# Altium schematic sheet Sheet1.SchDoc
size A4
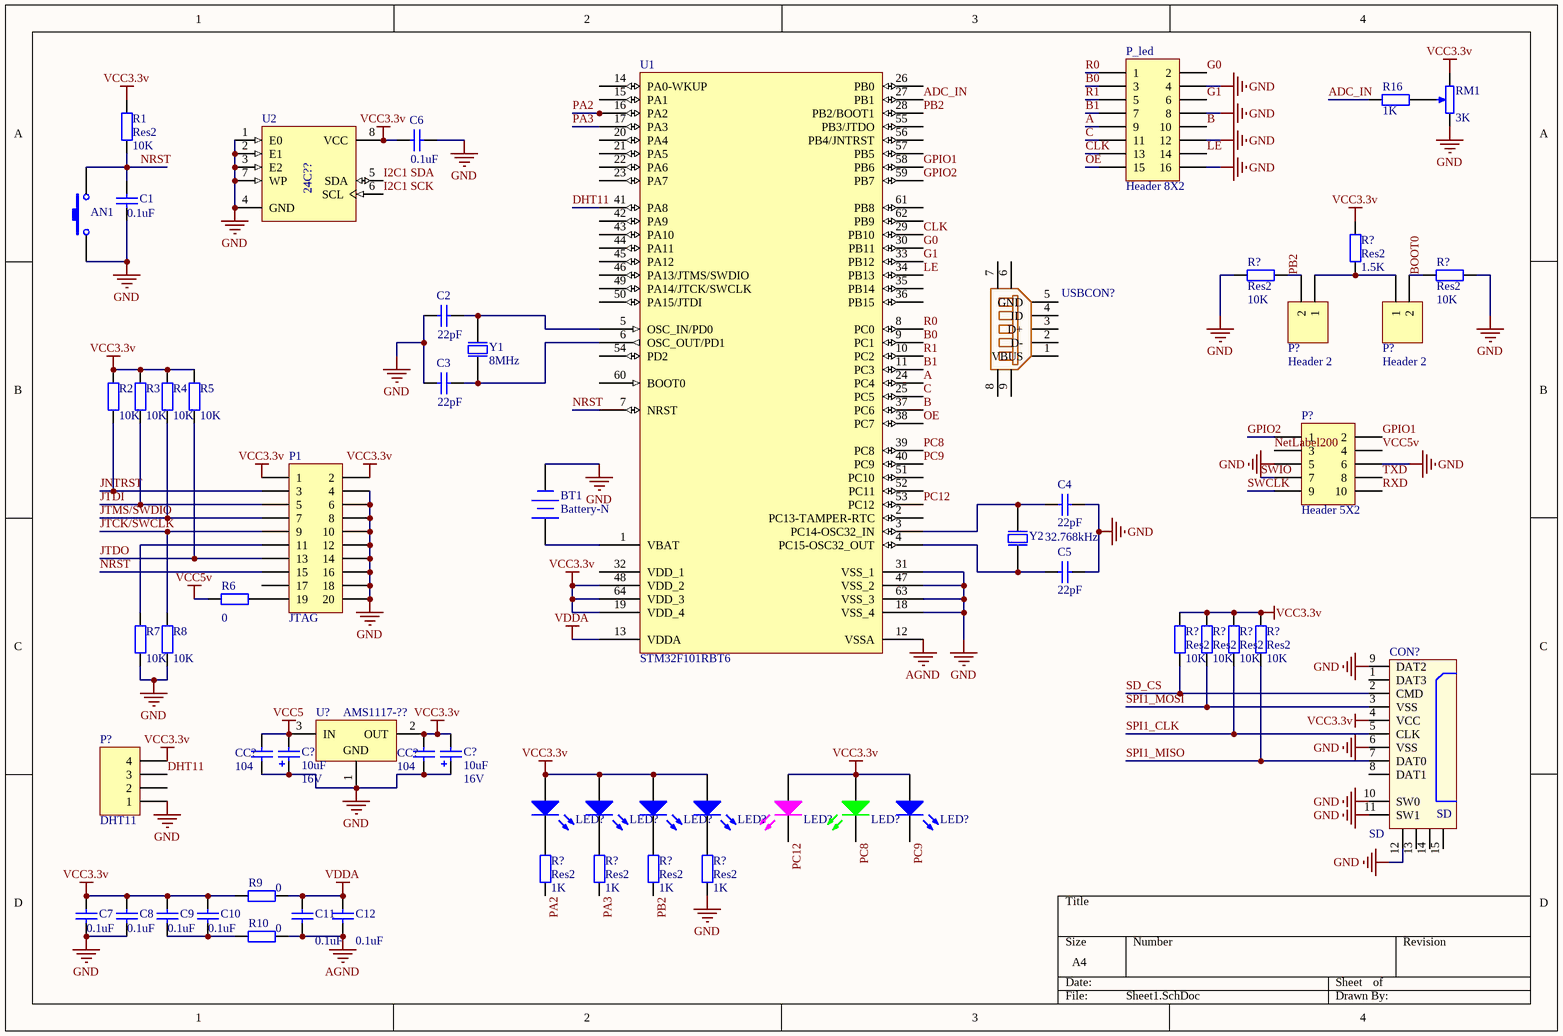
[diagram p0: Sheet1.SchDoc]

## Parts
(Parts that share a designator on the sheet are numbered #1, #2 ... from top to bottom, then left to right.)
AN1  Button  [BUTTON-DIP]  (value not drawn)
BT1  Battery-N  [BAT-CR2032]
C1  value 0.1uF  [RAD-0.3]  (hidden comment: Cap)
C2  value 22pF  [RAD-0.3]  (hidden comment: Cap)
C3  value 22pF  [RAD-0.3]  (hidden comment: Cap)
C4  value 22pF  [RAD-0.3]  (hidden comment: Cap)
C5  value 22pF  [RAD-0.3]  (hidden comment: Cap)
C6  value 0.1uF  [RAD-0.3]  (hidden comment: Cap)
C7  value 0.1uF  [RAD-0.3]  (hidden comment: Cap)
C8  value 0.1uF  [RAD-0.3]  (hidden comment: Cap)
C9  value 0.1uF  [RAD-0.3]  (hidden comment: Cap)
C10  value 0.1uF  [RAD-0.3]  (hidden comment: Cap)
C11  value 0.1uF  [RAD-0.3]  (hidden comment: Cap)
C12  value 0.1uF  [RAD-0.3]  (hidden comment: Cap)
C?#1  value 10uF  Voltage: 16V  [ED5]  (hidden comment: Cap Pol SMT D)
C?#2  value 10uF  Voltage: 16V  [ED5]  (hidden comment: Cap Pol SMT D)
CC?#1  value 104  [CC2012-0805]  (hidden comment: Cap Chip 0805)
CC?#2  value 104  [CC2012-0805]  (hidden comment: Cap Chip 0805)
CON?  SD  [SD_SHORT]
LED?#1  LED-3-B  [LED-R3-H5-SINGLE-B]  (value not drawn)
LED?#2  LED-3-B  [LED-R3-H5-SINGLE-B]  (value not drawn)
LED?#3  LED-3-B  [LED-R3-H5-SINGLE-B]  (value not drawn)
LED?#4  LED-3-B  [LED-R3-H5-SINGLE-B]  (value not drawn)
LED?#5  LED-3-R  [LED-R3-H5-SINGLE-R]  (value not drawn)
LED?#6  LED-3-G  [LED-R3-H5-SINGLE-G]  (value not drawn)
LED?#7  LED-3-B  [LED-R3-H5-SINGLE-B]  (value not drawn)
P1  JTAG  [HDR2X10]
P?#1  Header 2  [HDR1X2]
P?#2  Header 2  [HDR1X2]
P?#3  Header 5X2  [HDR2X5]
P?#4  DHT11  [HDR1X4]
P_led  Header 8X2  [HDR2X8]
R1  Res2  value 10K  [AXIAL-0.4]
R2  value 10K  [AXIAL-0.4]  (hidden comment: Res2)
R3  value 10K  [AXIAL-0.4]  (hidden comment: Res2)
R4  value 10K  [AXIAL-0.4]  (hidden comment: Res2)
R5  value 10K  [AXIAL-0.4]  (hidden comment: Res2)
R6  value 0  [AXIAL-0.4]  (hidden comment: Res2)
R7  value 10K  [AXIAL-0.4]  (hidden comment: Res2)
R8  value 10K  [AXIAL-0.4]  (hidden comment: Res2)
R9  value 0  [AXIAL-0.4]  (hidden comment: Res2)
R10  value 0  [AXIAL-0.4]  (hidden comment: Res2)
R16  value 1K  [CR2012-0805]  (hidden comment: Resistor Chip 0805)
R?#1  Res2  value 10K  [AXIAL-0.4]
R?#2  Res2  value 1.5K  [AXIAL-0.4]
R?#3  Res2  value 10K  [AXIAL-0.4]
R?#4  Res2  value 10K  [AXIAL-0.4]
R?#5  Res2  value 10K  [AXIAL-0.4]
R?#6  Res2  value 10K  [AXIAL-0.4]
R?#7  Res2  value 10K  [AXIAL-0.4]
R?#8  Res2  value 1K  [AXIAL-0.4]
R?#9  Res2  value 1K  [AXIAL-0.4]
R?#10  Res2  value 1K  [AXIAL-0.4]
R?#11  Res2  value 1K  [AXIAL-0.4]
RM1  value 3K  [POT BIG]  (hidden comment: Res Adj Pot)
U1  STM32F101RBT6  [LQFP64_N]
U2  24CXXSOP  [SOP-8N]  (value not drawn)
U?  AMS1117-??  [SOT-223]
USBCON?  USB-5P  [USB-MINI-B]  (value not drawn)
Y1  Frequency: 8MHz  [XTAL]  (hidden comment: XTAL)
Y2  Frequency: 32.768kHz  [XTAL]  (hidden comment: XTAL)

## Nets
AGND: C11.1 C12.1 R10.2 U1.12(VSSA)
GND: AN1.2 BT1.1(-) C1.1 C2.1 C3.1 C4.1 C5.1 C6.2 C7.1 C8.1 C?#1.1 C?#2.1 CC?#1.1 CC?#2.1 CON?.6(VSS) CON?.9(DAT2) CON?.10(SW0) CON?.11(SW1) CON?.12 P1.4 P1.6 P1.8 P1.10 P1.12 P1.14 P1.16 P1.18 P1.20 P?#3.5 P?#3.6 P?#4.1 P_led.4 P_led.8 P_led.12 P_led.16 R7.1 R8.1 R?#1.1 R?#3.1 R?#11.1 RM1.2(BOT) U1.18(VSS_4) U1.31(VSS_1) U1.47(VSS_2) U1.63(VSS_3) U2.1(E0) U2.2(E1) U2.3(E2) U2.4(GND) U2.7(WP) U?.1(GND)
VCC3.3v: C6.1 C7.2 C8.2 C9.2 C10.2 C?#2.2 CC?#2.2 CON?.4(VCC) LED?#1.1(A) LED?#2.1(A) LED?#3.1(A) LED?#4.1(A) LED?#5.1(A) LED?#6.1(A) LED?#7.1(A) P1.1 P1.2 P?#4.4 R1.2 R2.2 R3.2 R4.2 R5.2 R9.1 R?#2.2 R?#4.2 R?#5.2 R?#6.2 R?#7.2 RM1.1(TOP) U1.19(VDD_4) U1.48(VDD_2) U1.64(VDD_3) U2.8(VCC) U?.2(OUT)
VCC5: C?#1.2 CC?#1.2 U?.3(IN)
VCC5v: P?#3.4 R6.1
VDDA: C11.2 C12.2 R9.2 U1.13(VDDA)
A: P_led.9 U1.24(PC4)
ADC_IN: R16.1 U1.27(PB1)
B: P_led.10 U1.37(PC6)
B0: P_led.3 U1.9(PC1)
B1: P_led.7 U1.11(PC3)
BOOT0: P?#2.2 R?#3.2
C: P_led.11 U1.25(PC5)
CLK: P_led.13 U1.29(PB10)
DHT11: P?#4.3 U1.41(PA8)
G0: P_led.2 U1.30(PB11)
G1: P_led.6 U1.33(PB12)
GPIO1: P?#3.2 U1.58(PB6)
GPIO2: P?#3.1 U1.59(PB7)
I2C1 SCK: U2.6(SCL)
I2C1 SDA: U2.5(SDA)
JNTRST: P1.3 R2.1
JTCK/SWCLK: P1.9 R8.2
JTDI: P1.5 R3.1
JTDO: P1.13 R5.1
JTMS/SWDIO: P1.7 R4.1
LE: P_led.14 U1.34(PB13)
NetLabel200: P?#3.3
NRST: AN1.1 C1.2 P1.15 R1.1 U1.7(NRST)
OE: P_led.15 U1.38(PC7)
PA2: R?#8.1 U1.16(PA2)
PA3: R?#9.1 U1.17(PA3)
PB2: P?#1.2 R?#1.2 R?#10.1 U1.28(PB2/BOOT1)
PC8: LED?#6.2(K) U1.39(PC8)
PC9: LED?#7.2(K) U1.40(PC9)
PC12: LED?#5.2(K) U1.53(PC12)
R0: P_led.1 U1.8(PC0)
R1: P_led.5 U1.10(PC2)
RXD: P?#3.10
SD_CS: CON?.2(CMD) R?#4.1
SPI1_CLK: CON?.5(CLK) R?#6.1
SPI1_MISO: CON?.7(DAT0) R?#7.1
SPI1_MOSI: CON?.3(VSS) R?#5.1
SWCLK: P?#3.9
SWIO: P?#3.7
TXD: P?#3.8
NetBT1_2: BT1.2(+) U1.1(VBAT)
NetC2_2: C2.2 U1.5(OSC_IN/PD0) Y1.2(OSC2)
NetC3_2: C3.2 U1.6(OSC_OUT/PD1) Y1.1(OSC1)
NetC4_2: C4.2 U1.3(PC14-OSC32_IN) Y2.2(OSC2)
NetC5_2: C5.2 U1.4(PC15-OSC32_OUT) Y2.1(OSC1)
NetC9_1: C9.1 C10.1 R10.1
NetLED?#1_2: LED?#1.2(K) R?#8.2
NetLED?#2_2: LED?#2.2(K) R?#9.2
NetLED?#3_2: LED?#3.2(K) R?#10.2
NetLED?#4_2: LED?#4.2(K) R?#11.2
NetP1_11: P1.11 R7.2
NetP1_19: P1.19 R6.2
NetP?#1_1: P?#1.1 P?#2.1 R?#2.1
NetR16_2: R16.2 RM1.3(TAP)

Not connected (* = marked no-connect by the designer): CON? 1(DAT3) 8(DAT1) 13 14 15; P1 17; P?#4 2; U1 2(PC13-TAMPER-RTC) 14(PA0-WKUP) 15(PA1) 20(PA4) 21(PA5) 22(PA6) 23(PA7) 26(PB0) 32(VDD_1) 35(PB14) 36(PB15) 42(PA9) 43(PA10) 44(PA11) 45(PA12) 46(PA13/JTMS/SWDIO) 49(PA14/JTCK/SWCLK) 50(PA15/JTDI) 51(PC10) 52(PC11) 54(PD2) 55(PB3/JTDO) 56(PB4/JNTRST) 57(PB5) 60(BOOT0) 61(PB8) 62(PB9); USBCON? 1(VBUS) 2(D-) 3(D+) 4(ID) 5(GND) 6(GND) 7(GND) 8(GND) 9(GND)

## Notes on the sheet
- (in symbol 24CXXSOP) 24C??

## Library data of the parts
BT1 = Battery-N: Multicell Battery; Published: 24-Mar-1999; Revision: July-2002: Re-released for DXP Platform.; Publisher: Altium Limited
C1-C12 = Cap: Capacitor; Published: 8-Jun-2000; LatestRevisionDate: 17-Jul-2002; LatestRevisionNote: Re-released for DXP Platform.; PackageReference: RAD-0.3; Publisher: Altium Limited; PackageDescription: Radial Cap, Thru-Hole; 2 Leads; 0.3 in Pin Spacing
C?#1 C?#2 = Cap Pol SMT D: Polarized Capacitor (Radial); Published: 8-Jun-2000; Revision: July-2002: Re-released for DXP Platform.; Publisher: Altium Limited
CC?#1 CC?#2 = Cap Chip 0805: Polarized Capacitor (Radial); Published: 8-Jun-2000; Revision: July-2002: Re-released for DXP Platform.; Publisher: Altium Limited
LED?#1-LED?#4 LED?#7 = LED-3-B: Typical INFRARED GaAs LED; Published: 8-Jun-2000; Revision: July-2002: Re-released for DXP Platform.; Publisher: Altium Limited
LED?#5 = LED-3-R: Typical INFRARED GaAs LED; Published: 8-Jun-2000; Revision: July-2002: Re-released for DXP Platform.; Publisher: Altium Limited
LED?#6 = LED-3-G: Typical INFRARED GaAs LED; Published: 8-Jun-2000; Revision: July-2002: Re-released for DXP Platform.; Publisher: Altium Limited
P1 = Header 10X2: Header, 10-Pin, Dual row; LatestRevisionDate: 17-Jul-2002; LatestRevisionNote: Re-released for DXP Platform.; Publisher: Altium Limited
P?#1 P?#2 = Header 2: Header, 2-Pin; LatestRevisionDate: 17-Jul-2002; LatestRevisionNote: Re-released for DXP Platform.; Publisher: Altium Limited
P?#3 = Header 5X2: Header, 5-Pin, Dual row; LatestRevisionDate: 17-Jul-2002; LatestRevisionNote: Re-released for DXP Platform.; Publisher: Altium Limited
P?#4 = Header 4: Header, 4-Pin; LatestRevisionDate: 17-Jul-2002; LatestRevisionNote: Re-released for DXP Platform.; Publisher: Altium Limited
P_led = Header 8X2: Header, 8-Pin, Dual row; LatestRevisionDate: 17-Jul-2002; LatestRevisionNote: Re-released for DXP Platform.; Publisher: Altium Limited
R1-R10 R?#1-R?#11 = Res2: Resistor; Published: 8-Jun-2000; LatestRevisionDate: 17-Jul-2002; LatestRevisionNote: Re-released for DXP Platform.; PackageReference: AXIAL-0.4; Publisher: Altium Limited; PackageDescription: Axial Device, Thru-Hole; 2 Leads; 0.4 in Pin Spacing
R16 = Resistor Chip 0805: Resistor; Published: 8-Jun-2000; Revision: July-2002: Re-released for DXP Platform.; Publisher: Altium Limited
RM1 = Res Adj Pot: Potentiometer; Set Position: 0.5; Published: 8-Jun-2000; Revision: July-2002: Re-released for DXP Platform.; Publisher: Altium Limited
U1 = STM32F101RBT6: STM32 ARM-based 32-bit MCU with 128 Kbytes Flash, 64-pin LQFP, Industrial Temperature; Published: 30-May-2008; DatasheetVersion: rev6, Mar-2008; PackageVersion: Mar-2008; PackageReference: LQFP64; Publisher: Altium Limited; PackageDescription: 64-Pin Low-Profile Quad Flat Pack, 10 x 10 mm Body, 0.5 mm Pitch (LQFP64); ComponentLink1Description: Manufacturer Link; ComponentLink1URL: www.st.com/stm32; ComponentLink2Description: Datasheet; ComponentLink2URL: http://www.st.com/stonline/products/literature/ds/13586.pdf
U2 = 24CXXSOP: ??Kbit Serial  Bus EEPROM; Published: 24-Aug-2001; LatestRevisionDate: 13-Apr-2006; LatestRevisionNote: IPC-7351 Footprint Added.; DatasheetVersion: Sep-1999; PackageVersion: Jul-1999; PackageReference: SOP8; Publisher: Altium Limited; PackageDescription: 8-Pin Small Outline Integrated Circuit 1.27 mm Pitch; ComponentLink1Description: Manufacturer Link; ComponentLink1URL: http://www.st.com/; ComponentLink2Description: Datasheet; ComponentLink2URL: http://www.st.com/stonline/products/literature/ds/5067/m24c01-r.pdf
U? = AMS1117: POSITIVE OUTPUT VOLTAGE
USBCON? = USB-5P: USB CONNECTOR
Y1 Y2 = XTAL: Crystal Oscillator; Published: 8-Jun-2000; Revision: July-2002: Re-released for DXP Platform.; Publisher: Altium Limited
AN1 = Button: Published: 24-Mar-1999; LatestRevisionDate: 17-Jul-2002; LatestRevisionNote: Re-released for DXP Platform.; PackageReference: SPST-2; Publisher: Altium Limited